# Altium schematic sheet ADC.SchDoc
size A; SheetNumber: 3; SheetTotal: 7
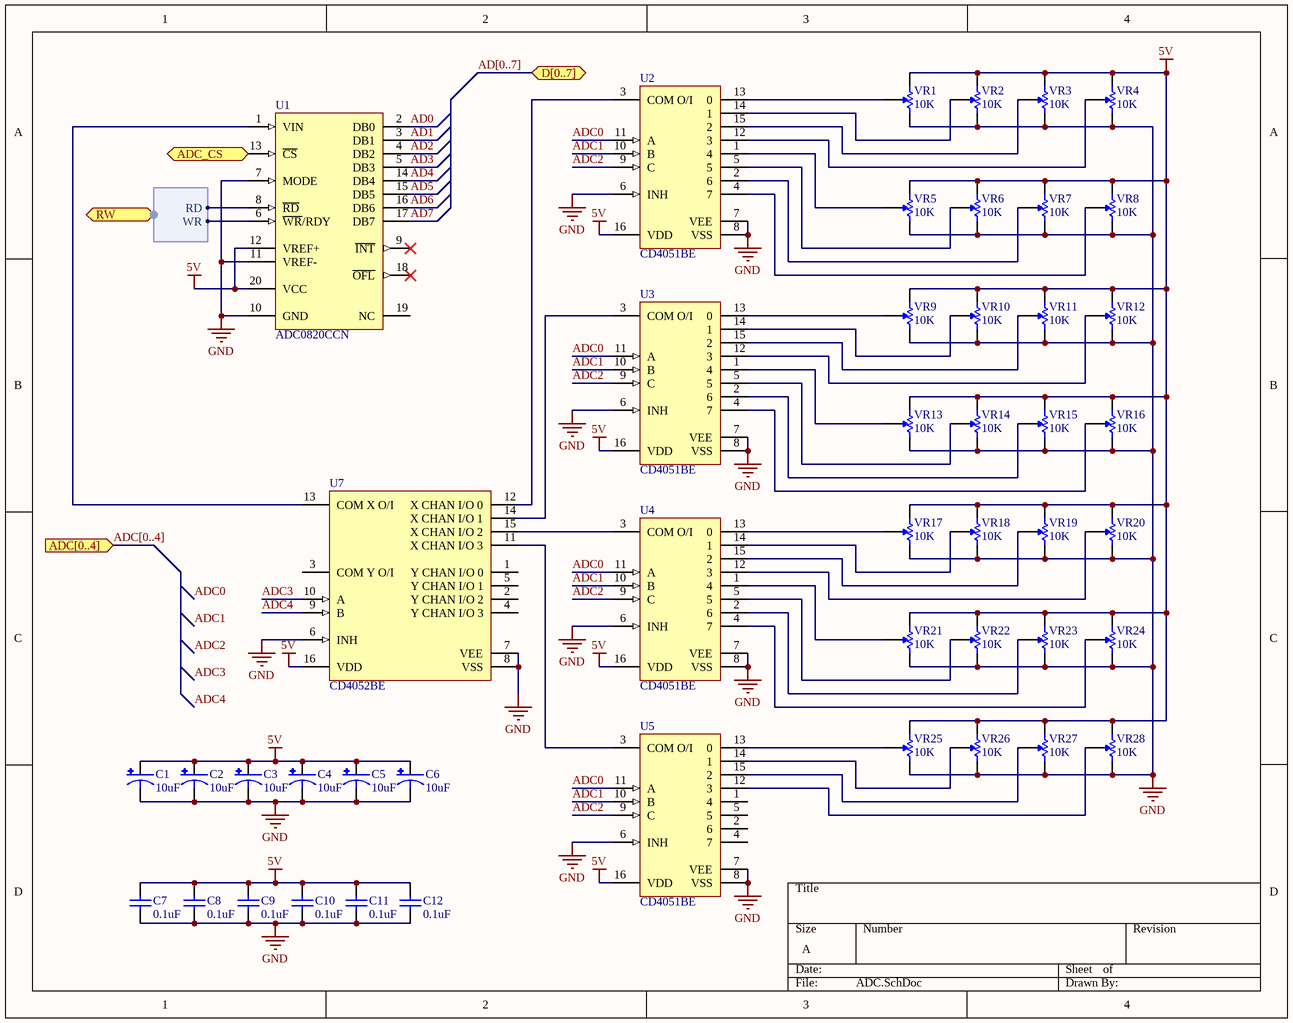
[diagram p0: ADC.SchDoc]

## Parts
C1  10uF  [CPOL-RADIAL]
C2  10uF  [CPOL-RADIAL]
C3  10uF  [CPOL-RADIAL]
C4  10uF  [CPOL-RADIAL]
C5  10uF  [CPOL-RADIAL]
C6  10uF  [CPOL-RADIAL]
C7  0.1uF  [CAP-PTH]
C8  0.1uF  [CAP-PTH]
C9  0.1uF  [CAP-PTH]
C10  0.1uF  [CAP-PTH]
C11  0.1uF  [CAP-PTH]
C12  0.1uF  [CAP-PTH]
U1  ADC0820CCN  [N20A]
U2  CD4051BE  [N0016A]
U3  CD4051BE  [N0016A]
U4  CD4051BE  [N0016A]
U5  CD4051BE  [N0016A]
U7  CD4052BE  [N0016A]
VR1  10K  [LINEAR_POT]
VR2  10K  [LINEAR_POT]
VR3  10K  [LINEAR_POT]
VR4  10K  [LINEAR_POT]
VR5  10K  [LINEAR_POT]
VR6  10K  [LINEAR_POT]
VR7  10K  [LINEAR_POT]
VR8  10K  [LINEAR_POT]
VR9  10K  [LINEAR_POT]
VR10  10K  [LINEAR_POT]
VR11  10K  [LINEAR_POT]
VR12  10K  [LINEAR_POT]
VR13  10K  [LINEAR_POT]
VR14  10K  [LINEAR_POT]
VR15  10K  [LINEAR_POT]
VR16  10K  [LINEAR_POT]
VR17  10K  [LINEAR_POT]
VR18  10K  [LINEAR_POT]
VR19  10K  [LINEAR_POT]
VR20  10K  [LINEAR_POT]
VR21  10K  [LINEAR_POT]
VR22  10K  [LINEAR_POT]
VR23  10K  [LINEAR_POT]
VR24  10K  [LINEAR_POT]
VR25  10K  [ROTARY_POT]
VR26  10K  [ROTARY_POT]
VR27  10K  [ROTARY_POT]
VR28  10K  [ROTARY_POT]

## Ports
ADC[0..4] (in), ADC_CS (in), D[0..7] (bidir), RW (harness RW)

## Harnesses
RW: WR, RD

## Nets
5V: C1.1(+) C2.1(+) C3.1(+) C4.1(+) C5.1(+) C6.1(+) C7.1 C8.1 C9.1 C10.1 C11.1 C12.1 U1.12(VREF+) U1.20(VCC) U2.16(VDD) U3.16(VDD) U4.16(VDD) U5.16(VDD) U7.16(VDD) VR1.1 VR2.1 VR3.1 VR4.1 VR5.1 VR6.1 VR7.1 VR8.1 VR9.1 VR10.1 VR11.1 VR12.1 VR13.1 VR14.1 VR15.1 VR16.1 VR17.1 VR18.1 VR19.1 VR20.1 VR21.1 VR22.1 VR23.1 VR24.1 VR25.1 VR26.1 VR27.1 VR28.1
GND: C1.2(-) C2.2(-) C3.2(-) C4.2(-) C5.2(-) C6.2(-) C7.2 C8.2 C9.2 C10.2 C11.2 C12.2 U1.7(MODE) U1.10(GND) U1.11(VREF-) U2.6(INH) U2.7(VEE) U2.8(VSS) U3.6(INH) U3.7(VEE) U3.8(VSS) U4.6(INH) U4.7(VEE) U4.8(VSS) U5.6(INH) U5.7(VEE) U5.8(VSS) U7.6(INH) U7.7(VEE) U7.8(VSS) VR1.3 VR2.3 VR3.3 VR4.3 VR5.3 VR6.3 VR7.3 VR8.3 VR9.3 VR10.3 VR11.3 VR12.3 VR13.3 VR14.3 VR15.3 VR16.3 VR17.3 VR18.3 VR19.3 VR20.3 VR21.3 VR22.3 VR23.3 VR24.3 VR25.3 VR26.3 VR27.3 VR28.3
AD0: U1.2(DB0)
AD1: U1.3(DB1)
AD2: U1.4(DB2)
AD3: U1.5(DB3)
AD4: U1.14(DB4)
AD5: U1.15(DB5)
AD6: U1.16(DB6)
AD7: U1.17(DB7)
ADC0: U2.11(A) U3.11(A) U4.11(A) U5.11(A)
ADC1: U2.10(B) U3.10(B) U4.10(B) U5.10(B)
ADC2: U2.9(C) U3.9(C) U4.9(C) U5.9(C)
ADC3: U7.10(A)
ADC4: U7.9(B)
ADC_CS: U1.13(~{CS}) ; port ADC_CS
NetU1_1: U1.1(VIN) U7.13(COM_X_O/I)
NetU1_6: U1.6(~{WR}/RDY) ; port RW.WR
NetU1_8: U1.8(~{RD}) ; port RW.RD
NetU2_1: U2.1(4) VR5.2
NetU2_2: U2.2(6) VR7.2
NetU2_3: U2.3(COM_O/I) U7.12(X_CHAN_I/O_0)
NetU2_4: U2.4(7) VR8.2
NetU2_5: U2.5 VR6.2
NetU2_12: U2.12(3) VR4.2
NetU2_13: U2.13(0) VR1.2
NetU2_14: U2.14(1) VR2.2
NetU2_15: U2.15(2) VR3.2
NetU3_1: U3.1(4) VR13.2
NetU3_2: U3.2(6) VR15.2
NetU3_3: U3.3(COM_O/I) U7.14(X_CHAN_I/O_1)
NetU3_4: U3.4(7) VR16.2
NetU3_5: U3.5 VR14.2
NetU3_12: U3.12(3) VR12.2
NetU3_13: U3.13(0) VR9.2
NetU3_14: U3.14(1) VR10.2
NetU3_15: U3.15(2) VR11.2
NetU4_1: U4.1(4) VR21.2
NetU4_2: U4.2(6) VR23.2
NetU4_3: U4.3(COM_O/I) U7.15(X_CHAN_I/O_2)
NetU4_4: U4.4(7) VR24.2
NetU4_5: U4.5 VR22.2
NetU4_12: U4.12(3) VR20.2
NetU4_13: U4.13(0) VR17.2
NetU4_14: U4.14(1) VR18.2
NetU4_15: U4.15(2) VR19.2
NetU5_3: U5.3(COM_O/I) U7.11(X_CHAN_I/O_3)
NetU5_12: U5.12(3) VR28.2
NetU5_13: U5.13(0) VR25.2
NetU5_14: U5.14(1) VR26.2
NetU5_15: U5.15(2) VR27.2

Not connected (* = marked no-connect by the designer): U1 9(~{INT})* 18(~{OFL})* 19(NC); U5 1(4) 2(6) 4(7) 5; U7 1(Y_CHAN_I/O_0) 2(Y_CHAN_I/O_2) 3(COM_Y_O/I) 4(Y_CHAN_I/O_3) 5(Y_CHAN_I/O_1)

## Buses and harness runs
bus AD[0..7] = port D[0..7]
bus ADC[0..4] = port ADC[0..4]

## Notes on the sheet
- Labels drawn without touching a wire or pin: ADC0, ADC1, ADC2, ADC3, ADC4

## Library data of the parts
C1-C6 = PolarizedCap
C7-C12 = Cap
U1 = CMP-0054-00020-2: 8-Bit High Speed uP Compatible A/D Converter with Track/Hold Function, 20-pin MDIP; Manufacturer: National Semiconductor; PowerWise: N; CompType: ADC IC; PackageTopMarking: NSUZXYYTTE#*ADC0820CCN; ComponentLink1URL: http://www.national.com/ds/AD/ADC0820.pdf; PinCount: 20; DatasheetVersion: May-1998; Code_JEDEC: MS-001-AD; ComponentLink2URL: http://www.national.com/pf/AD/ADC0820.html; PackageDescription: Molded Dip (N) 20 Lead; ComponentLink3URL: http://www.national.com/packaging/folders/n20a.html; PackageReference: N20A; ComponentLink2Description: ADC0820 Web Page; RevisionNote: Component URLs added; RoHS: N; PackageVersion: revG, Nov-1984; ComponentLink1Description: ADC0820 Datasheet; ComponentLink3Description: N20A Package Page
U2-U5 = CMP-1575-00059-4: CMOS Single 8-Channel Analog Multiplexer/Demultiplexer with Logic-Level Conversion, N0016A, TUBE; Manufacturer: Texas Instruments; VCC(Max)(V): 18; ICC(Typ)(mA): 0.00008; Output Drive (IOL/IOH)(Max)(mA): 1; Bandwidth(Max)(MHz): 20; Rating: Military; VCC(Min)(V): 5; Configuration: 1 X 1：8 MUX; Crosstalk: Yes; Ron(Max)(Ohms): 240; Ron(Typ)(Ohms): 125; DatasheetVersion: SCHS047G; Output Type: CMOS; PackageVersion: http://www.ti.com/lit/ml/mpdi002c/mpdi002c.pdf; Operating Temperature Range(C): -55 to 125; Generic Part Number: CD4051B; PackageReference: N0016A; Code_JEDEC: MS-001
U7 = CMP-1575-00066-4: CMOS Differential 4-Channel Analog Multiplexer/Demultiplexer with Logic-Level Conversion, N0016A, TUBE; Manufacturer: Texas Instruments; Bandwidth(Max)(MHz): 25; Ron(Typ)(Ohms): 125; Rating: Catalog; Crosstalk: Yes; VCC(Max)(V): 18; ICC(Typ)(mA): 0.00008; Ron(Max)(Ohms): 240; VCC(Min)(V): 5; Configuration: 2 X 1：4 MUX; Code_JEDEC: MS-001; PackageVersion: http://www.ti.com/lit/ml/mpdi002c/mpdi002c.pdf; DatasheetVersion: SCHS047G; Generic Part Number: CD4052B; Output Type: CMOS; Operating Temperature Range(C): -55 to 125; PackageReference: N0016A
VR1-VR24 = LinearPot
VR25-VR28 = RotaryPot